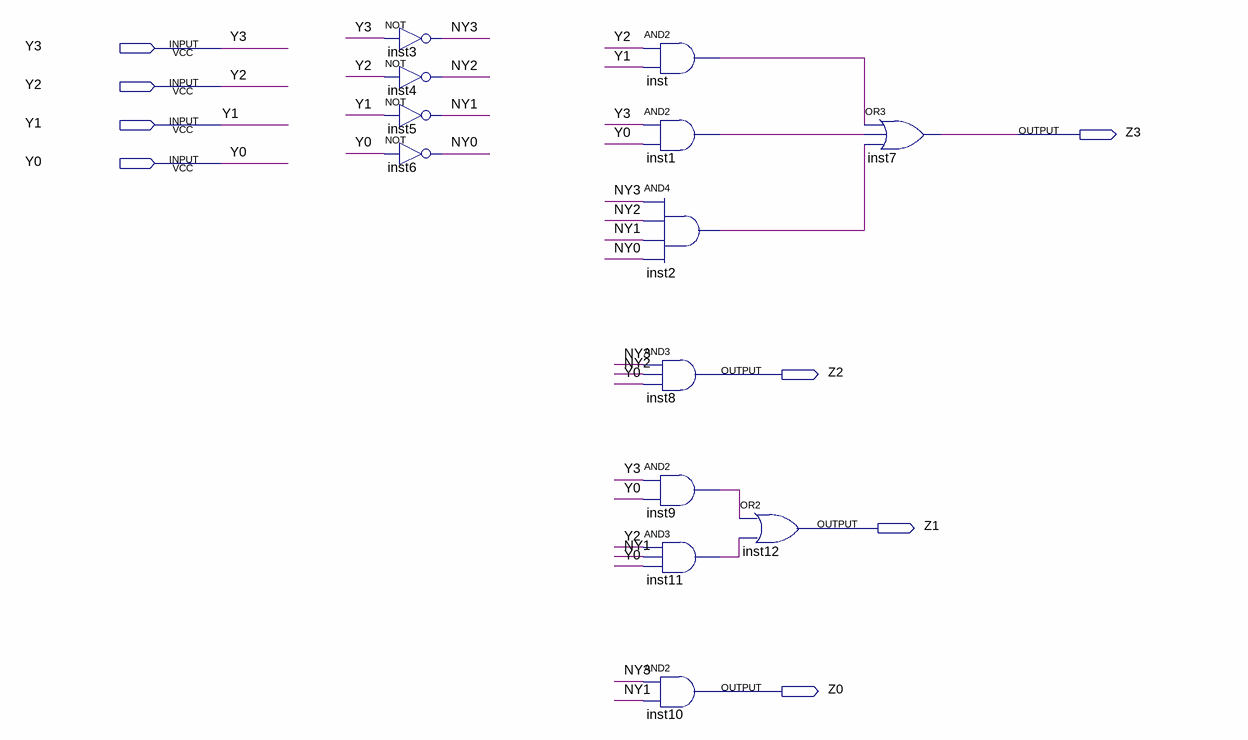
[diagram p0: schematic sheet]
// Quartus schematic CCSaida.bdf as structural Verilog: 13 symbols, 8 pins
module CCSaida (
  input  Y3,
  input  Y2,
  input  Y1,
  input  Y0,
  output Z3,
  output Z2,
  output Z1,
  output Z0
);

  wire inst1_out, inst2_out, inst9_out, inst11_out, inst_out, NY0, NY1, NY2, NY3;

  not inst3 (NY3, Y3);
  not inst4 (NY2, Y2);
  not inst5 (NY1, Y1);
  not inst6 (NY0, Y0);
  and inst (inst_out, Y2, Y1);
  and inst1 (inst1_out, Y3, Y0);
  and inst2 (inst2_out, NY3, NY2, NY1, NY0);
  and inst8 (Z2, NY3, NY2, Y0);
  and inst9 (inst9_out, Y3, Y0);
  and inst11 (inst11_out, Y2, NY1, Y0);
  and inst10 (Z0, NY3, NY1);
  or inst12 (Z1, inst9_out, inst11_out);
  or inst7 (Z3, inst_out, inst1_out, inst2_out);
endmodule
